# EAGLE design ant_track_2 (EAGLE 4.16)
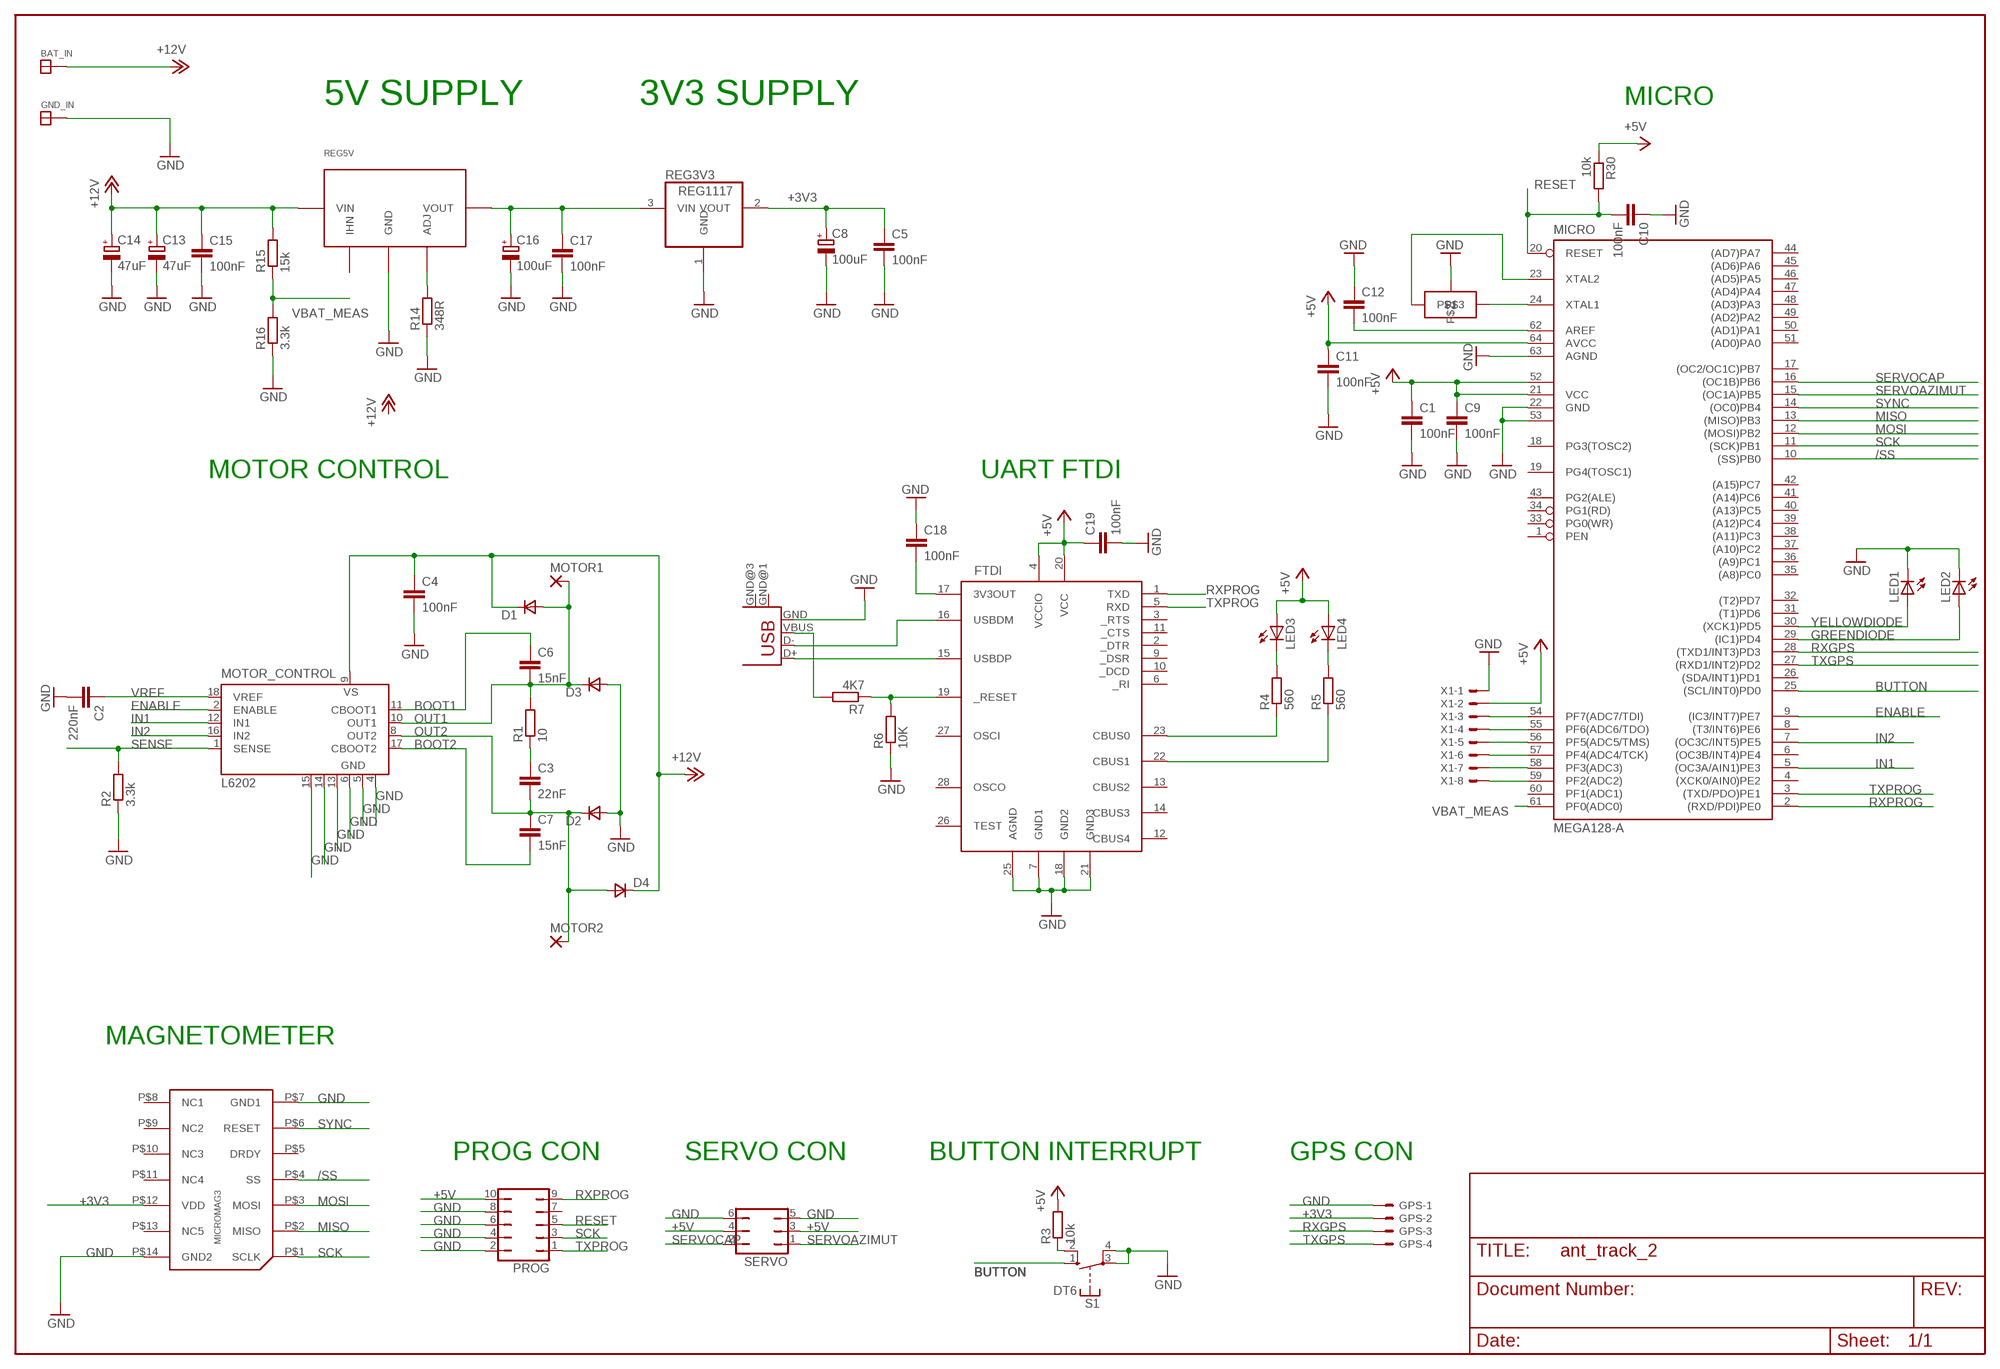
[diagram p0: schematic, sheet 1]

## Parts
BAT_IN  SOLDER_PAD150_75  [SOLD_PAD_150_75]
C1  100nF  C-EUC1206  [C1206]
C2  220nF  C-EUC1206  [C1206]
C3  22nF  C-EUC1206  [C1206]
C4  100nF  C-EUC1206  [C1206]
C5  100nF  C-EUC1206K  [C1206K]
C6  15nF  C-EUC1206  [C1206]
C7  15nF  C-EUC1206  [C1206]
C8  100uF  CPOL-EUSMCD  [SMC_D]
C9  100nF  C-EUC1206  [C1206]
C10  100nF  C-EUC1206  [C1206]
C11  100nF  C-EUC1206  [C1206]
C12  100nF  C-EUC1206  [C1206]
C13  47uF  CPOL-EUSMCD  [SMC_D]
C14  47uF  CPOL-EUSMCD  [SMC_D]
C15  100nF  C-EUC1206  [C1206]
C16  100uF  CPOL-EUSMCD  [SMC_D]
C17  100nF  C-EUC1206K  [C1206K]
C18  100nF  C-EUC0603K  [C0603K]
C19  100nF  C-EUC0603K  [C0603K]
D1  VAR2SOT23  [SOT-23]
D2  VAR2SOT23  [SOT-23]
D3  VAR2SOT23  [SOT-23]
D4  VAR2SOT23  [SOT-23]
FTDI  FT232RL  [SSOP28DB]
GND_IN  SOLDER_PAD150_75  [SOLD_PAD_150_75]
GPS  53047-04  [53047-04]
LED1  LEDCHIPLED_0805  [CHIPLED_0805]
LED2  LEDCHIPLED_0805  [CHIPLED_0805]
LED3  LEDCHIPLED_0805  [CHIPLED_0805]
LED4  LEDCHIPLED_0805  [CHIPLED_0805]
MICRO  MEGA128-A  [TQFP64]
MOTOR1  2,54/0,8  [2,54/0,8]
MOTOR2  2,54/0,8  [2,54/0,8]
MOTOR_CONTROL  L6202  [DIL18]
PROG  JP5Q  [JP5Q]
R1  10  R-EU_R1206  [R1206]
R2  3.3k  R-EU_R1206  [R1206]
R3  10k  R-EU_R1206W  [R1206W]
R4  560  R-EU_R0805  [R0805]
R5  560  R-EU_R0805  [R0805]
R6  10K  R-EU_R0603  [R0603]
R7  4K7  R-EU_R0603  [R0603]
R14  348R  R-EU_R1206  [R1206]
R15  15k  R-EU_R1206  [R1206]
R16  3.3k  R-EU_R1206  [R1206]
R30  10k  R-EU_R1206W  [R1206W]
REG3V3  REG1117  [SOT223]
REG5V  PTH  [PTH]
S1  DT6  [DT6]
SERVO  JP3Q  [JP3Q]
U$1  MICROMAG3  [MICROMAG3]
U$2  MICRO_RESO  [MICRO_CRYSTAL]
USB1  USB-MB-S  [USB-MB-S]
X1  53047-08  [53047-08]

## Nets
+3V3: C5.1 C8.+ GPS.2 REG3V3.2(VOUT) U$1.P$12(VDD)
+5V: C1.1 C9.1 C11.1 C16.+ C17.1 C19.1 FTDI.4(VCCIO) FTDI.20(VCC) LED3.A LED4.A MICRO.21(VCC) MICRO.52(VCC1) MICRO.64(AVCC) PROG.10 R3.2 R30.1 REG3V3.3(VIN) REG5V.P$3(VOUT) SERVO.3 SERVO.4 X1.2
+12V: BAT_IN.P$1 C4.1 C13.+ C14.+ C15.1 D1.1(C) D4.1(C) MOTOR_CONTROL.9(VS) R15.2 REG5V.P$1(VIN)
/SS: MICRO.10((SS)PB0) U$1.P$4(SS)
BOOT1: C6.1 MOTOR_CONTROL.11(CBOOT1)
BOOT2: C7.2 MOTOR_CONTROL.17(CBOOT2)
BUTTON: MICRO.25((SCL/INT0)PD0) S1.1(S)
ENABLE: MICRO.9((IC3/INT7)PE7) MOTOR_CONTROL.2(ENABLE)
GND: C1.2 C2.2 C4.2 C5.2 C8.- C9.2 C10.1 C11.2 C12.1 C13.- C14.- C15.2 C16.- C17.2 C18.1 C19.2 D2.3(A) D3.3(A) FTDI.7(GND1) FTDI.18(GND2) FTDI.21(GND3) FTDI.25(AGND) GND_IN.P$1 GPS.1 LED1.C LED2.C MICRO.22(GND) MICRO.53(GND1) MICRO.63(AGND) MOTOR_CONTROL.4(GND) MOTOR_CONTROL.5(GND) MOTOR_CONTROL.6(GND) MOTOR_CONTROL.13(GND) MOTOR_CONTROL.14(GND) MOTOR_CONTROL.15(GND) PROG.2 PROG.4 PROG.6 PROG.8 R2.1 R6.1 R14.1 R16.1 REG3V3.1(GND) REG5V.P$2(GND) S1.3(P) S1.4(P) SERVO.5 SERVO.6 U$1.P$7(GND1) U$1.P$14(GND2) U$2.P$2 USB1.GND X1.1
GREENDIODE: LED2.A MICRO.29((IC1)PD4)
IN1: MICRO.5((OC3A/AIN1)PE3) MOTOR_CONTROL.12(IN1)
IN2: MICRO.7((OC3C/INT5)PE5) MOTOR_CONTROL.16(IN2)
MISO: MICRO.13((MISO)PB3) U$1.P$2(MISO)
MOSI: MICRO.12((MOSI)PB2) U$1.P$3(MOSI)
N$2: C3.1 R1.1
N$5: R14.2 REG5V.P$4(ADJ)
N$9: R3.1 S1.2(S)
N$15: C12.2 MICRO.62(AREF)
N$16: MICRO.24(XTAL1) U$2.P$3
N$17: MICRO.23(XTAL2) U$2.P$1
N$27: FTDI.15(USBDP) USB1.D+
N$28: FTDI.16(USBDM) USB1.D-
N$29: FTDI.23(CBUS0) R4.1
N$30: FTDI.22(CBUS1) R5.1
N$31: LED3.C R4.2
N$32: LED4.C R5.2
N$33: FTDI.19(_RESET) R6.2 R7.1
N$34: R7.2 USB1.VBUS
N$35: C18.2 FTDI.17(3V3OUT)
N$42: MICRO.54(PF7(ADC7/TDI)) X1.3
N$43: MICRO.55(PF6(ADC6/TDO)) X1.4
N$44: MICRO.56(PF5(ADC5/TMS)) X1.5
N$45: MICRO.57(PF4(ADC4/TCK)) X1.6
N$46: MICRO.58(PF3(ADC3)) X1.7
N$47: MICRO.59(PF2(ADC2)) X1.8
OUT1: C6.2 D1.3(A) D3.1(C) MOTOR1.1(P) MOTOR_CONTROL.10(OUT1) R1.2
OUT2: C3.2 C7.1 D2.1(C) D4.3(A) MOTOR2.1(P) MOTOR_CONTROL.8(OUT2)
RESET: C10.2 MICRO.20(RESET) PROG.5 R30.2
RXGPS: GPS.3 MICRO.28((TXD1/INT3)PD3)
RXPROG: FTDI.1(TXD) MICRO.2((RXD/PDI)PE0) PROG.9
SCK: MICRO.11((SCK)PB1) PROG.3 U$1.P$1(SCLK)
SENSE: MOTOR_CONTROL.1(SENSE) R2.2
SERVOAZIMUT: MICRO.15((OC1A)PB5) SERVO.1
SERVOCAP: MICRO.16((OC1B)PB6) SERVO.2
SYNC: MICRO.14((OC0)PB4) U$1.P$6(RESET)
TXGPS: GPS.4 MICRO.27((RXD1/INT2)PD2)
TXPROG: FTDI.5(RXD) MICRO.3((TXD/PDO)PE1) PROG.1
VBAT_MEAS: MICRO.61(PF0(ADC0)) R15.1 R16.2
VREF: C2.1 MOTOR_CONTROL.18(VREF)
YELLOWDIODE: LED1.A MICRO.30((XCK1)PD5)
Unconnected: FTDI.2(_DTR) FTDI.3(_RTS) FTDI.6(_RI) FTDI.9(_DSR) FTDI.10(_DCD) FTDI.11(_CTS) FTDI.12(CBUS4) FTDI.13(CBUS2) FTDI.14(CBUS3) FTDI.26(TEST) FTDI.27(OSCI) FTDI.28(OSCO) MICRO.1(PEN) MICRO.4((XCK0/AIN0)PE2) MICRO.6((OC3B/INT4)PE4) MICRO.8((T3/INT6)PE6) MICRO.17((OC2/OC1C)PB7) MICRO.18(PG3(TOSC2)) MICRO.19(PG4(TOSC1)) MICRO.26((SDA/INT1)PD1) MICRO.31((T1)PD6) MICRO.32((T2)PD7) MICRO.33(PG0(WR)) MICRO.34(PG1(RD)) MICRO.35((A8)PC0) MICRO.36((A9)PC1) MICRO.37((A10)PC2) MICRO.38((A11)PC3) MICRO.39((A12)PC4) MICRO.40((A13)PC5) MICRO.41((A14)PC6) MICRO.42((A15)PC7) MICRO.43(PG2(ALE)) MICRO.44((AD7)PA7) MICRO.45((AD6)PA6) MICRO.46((AD5)PA5) MICRO.47((AD4)PA4) MICRO.48((AD3)PA3) MICRO.49((AD2)PA2) MICRO.50((AD1)PA1) MICRO.51((AD0)PA0) MICRO.60(PF1(ADC1)) PROG.7 REG5V.P$5(IHN) U$1.P$5(DRDY) U$1.P$8(NC1) U$1.P$9(NC2) U$1.P$10(NC3) U$1.P$11(NC4) U$1.P$13(NC5) USB1.GND@1(GND) USB1.GND@3(GND)

## Notes on the sheet
- 5V SUPPLY | 3V3 SUPPLY | MICRO
- MOTOR CONTROL | UART FTDI
- MAGNETOMETER
- PROG CON | SERVO CON | BUTTON INTERRUPT | GPS CON

## Library data of the parts
BAT_IN GND_IN = paparazzi:SOLDER_PAD
C1-C7 C9-C12 C15 C17-C19 = rcl:C-EU: CAPACITOR, European symbol
C8 C13 C14 C16 = rcl:CPOL-EU: POLARIZED CAPACITOR, European symbol
D1-D4 = zetex:VAR2SOT23: DIODE
FTDI = ftdichip:FT232RL: USB UART 4th Generation USB UART (USB <-> Serial) Controller
GPS = con-molex:53?-04: CONNECTOR wire to board 1.25 mm (.049 inch) pitch header
LED1-LED4 = led:LED: LED OSRAM: - CHIPLED LG R971, LG N971, LY N971, LG Q971, LY Q971, LO R971, LY R971 LH N974, LH R974 LS Q976, LO Q976, LY Q976 LO Q996 - Hyper CHIPLED LW Q18S LB Q993, LB Q99A, LB R99A - SideLED LS A670, LO A670, LY A670, LG A670, LP A670 LB A673, LV A673, LT A673, LW A673 LH A674 LY A675 LS A676, LA A676, LO A676, LY A676, LW A676 LS A679, LY A679, LG A679 - Hyper Micro SIDELED® LS Y876, LA Y876, LO Y876, LY Y876 LT Y87S - SmartLED LW L88C, LW L88S LB L89C, LB L89S, LG L890 LS L89K, LO L89K, LY L89K LS L896, LA L896, LO L896, LY L896 - TOPLED LS T670, LO T670, LY T670, LG T670, LP T670 LSG T670, LSP T670, LSY T670, LOP T670, LYG T670 LG T671, LOG T671, LSG T671 LB T673, LV T673, LT T673, LW T673 LH T674 LS T676, LA T676, LO T676, LY T676, LB T676, LH T676, LSB T676, LW T676 LB T67C, LV T67C, LT T67C, LS T67K, LO T67K, LY T67K, LW E67C LS E67B, LA E67B, LO E67B, LY E67B, LB E67C, LV E67C, LT E67C LW T67C LS T679, LY T679, LG T679 LS T770, LO T770, LY T770, LG T770, LP T770 LB T773, LV T773, LT T773, LW T773 LH T774 LS E675, LA E675, LY E675, LS T675 LS T776, LA T776, LO T776, LY T776, LB T776 LHGB T686 LT T68C, LB T68C - Hyper Mini TOPLED® LB M676 - Mini TOPLED Santana® LG M470 LS M47K, LO M47K, LY M47K Source: http://www.osram.convergy.de/
MICRO = atmel:MEGA128: MICROCONTROLLER 128 Kbytes FLASH 4 Kbytes SRAM 4 Kbytes EEPROM DUAL USART 8-channel 10 bit ADC Source: avr.lbr
MOTOR1 MOTOR2 = wirepad:2,54/0,8: THROUGH-HOLE PAD
MOTOR_CONTROL = st-microelectronics:L620: DMOS FULL BRIDGE DRIVER
PROG = jumper:JP5Q: JUMPER
R1-R7 R14-R16 R30 = rcl:R-EU_: RESISTOR, European symbol
REG3V3 = burr-brown:REG1117: 800mA and 1A Low Dropout (LDO) Positive Regulator 1.8V, 2.5V, 2.85V, 3.3V, 5V, and Adj
REG5V = paparazzi:PTH
S1 = switch-misc:DT: ITT SWITCH
SERVO = jumper:JP3Q: JUMPER
U$1 = paparazzi:MICROMAG3
U$2 = paparazzi:MICRO_RESO
USB1 = con-usb-2:USB: USB Connectors
X1 = con-molex:53?-08: CONNECTOR wire to board 1.25 mm (.049 inch) pitch header

## Board
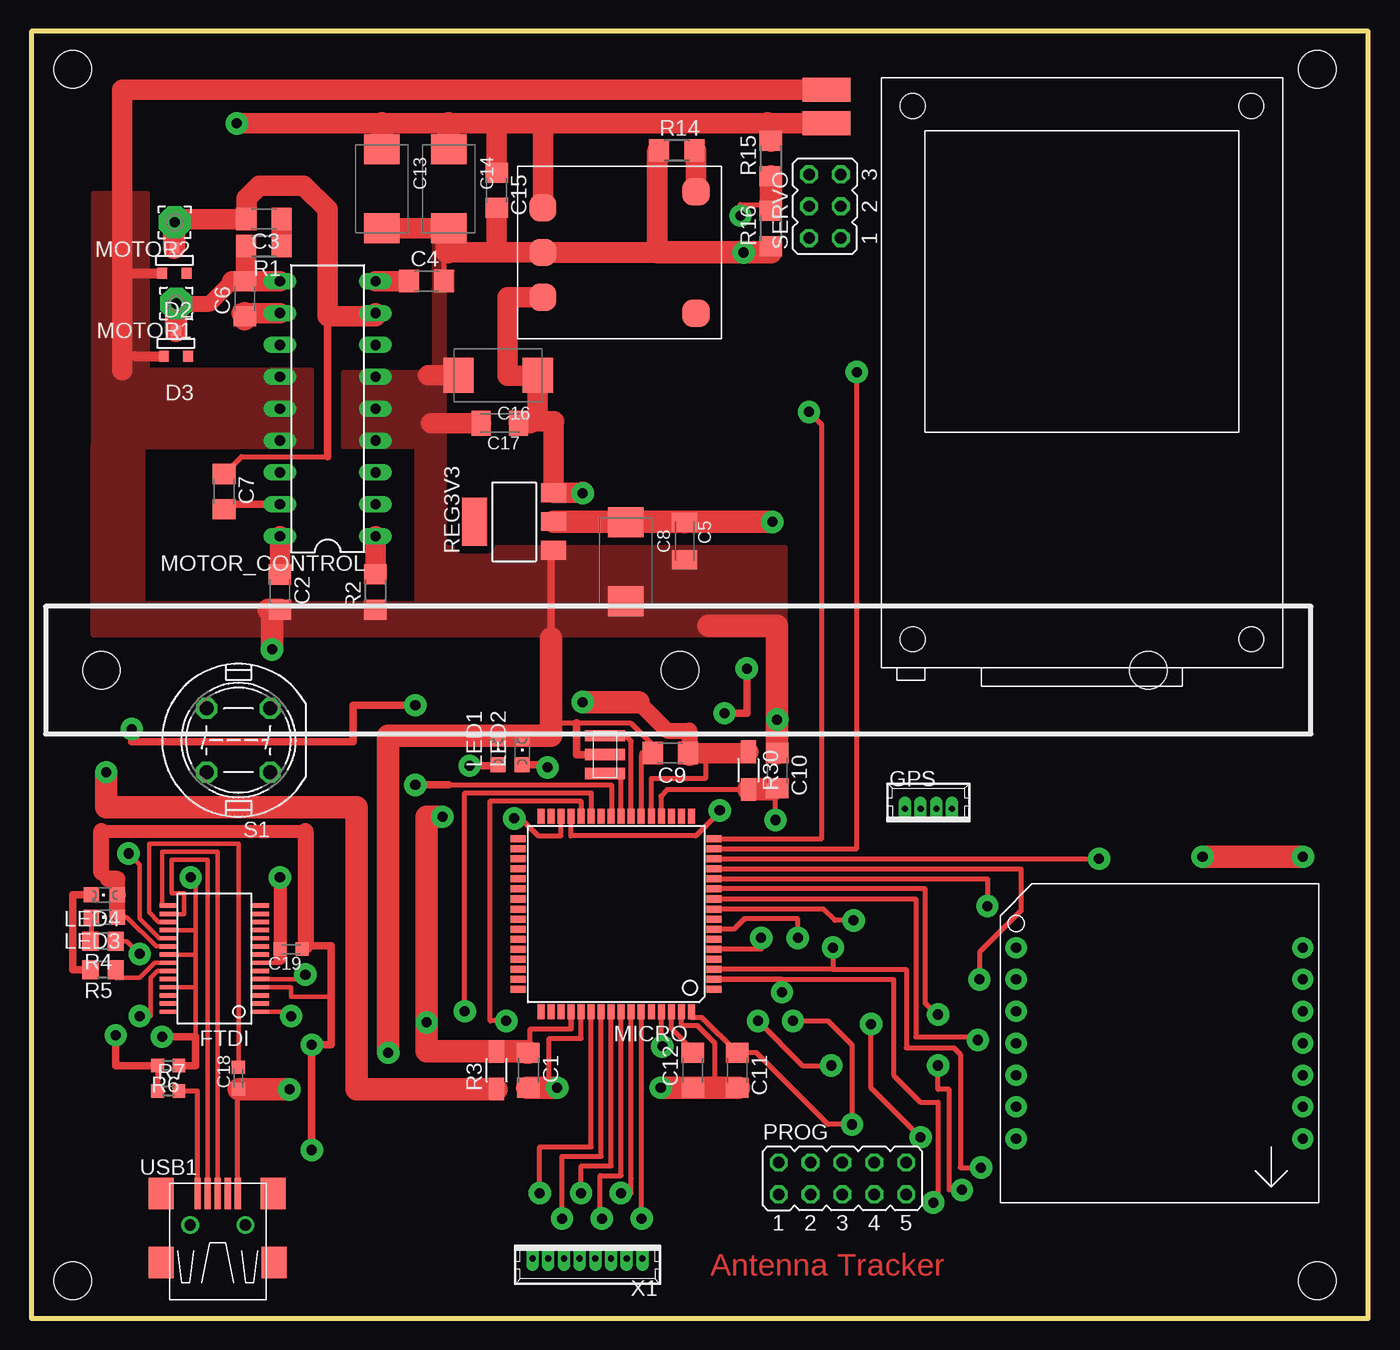
[diagram p1: board, top side]
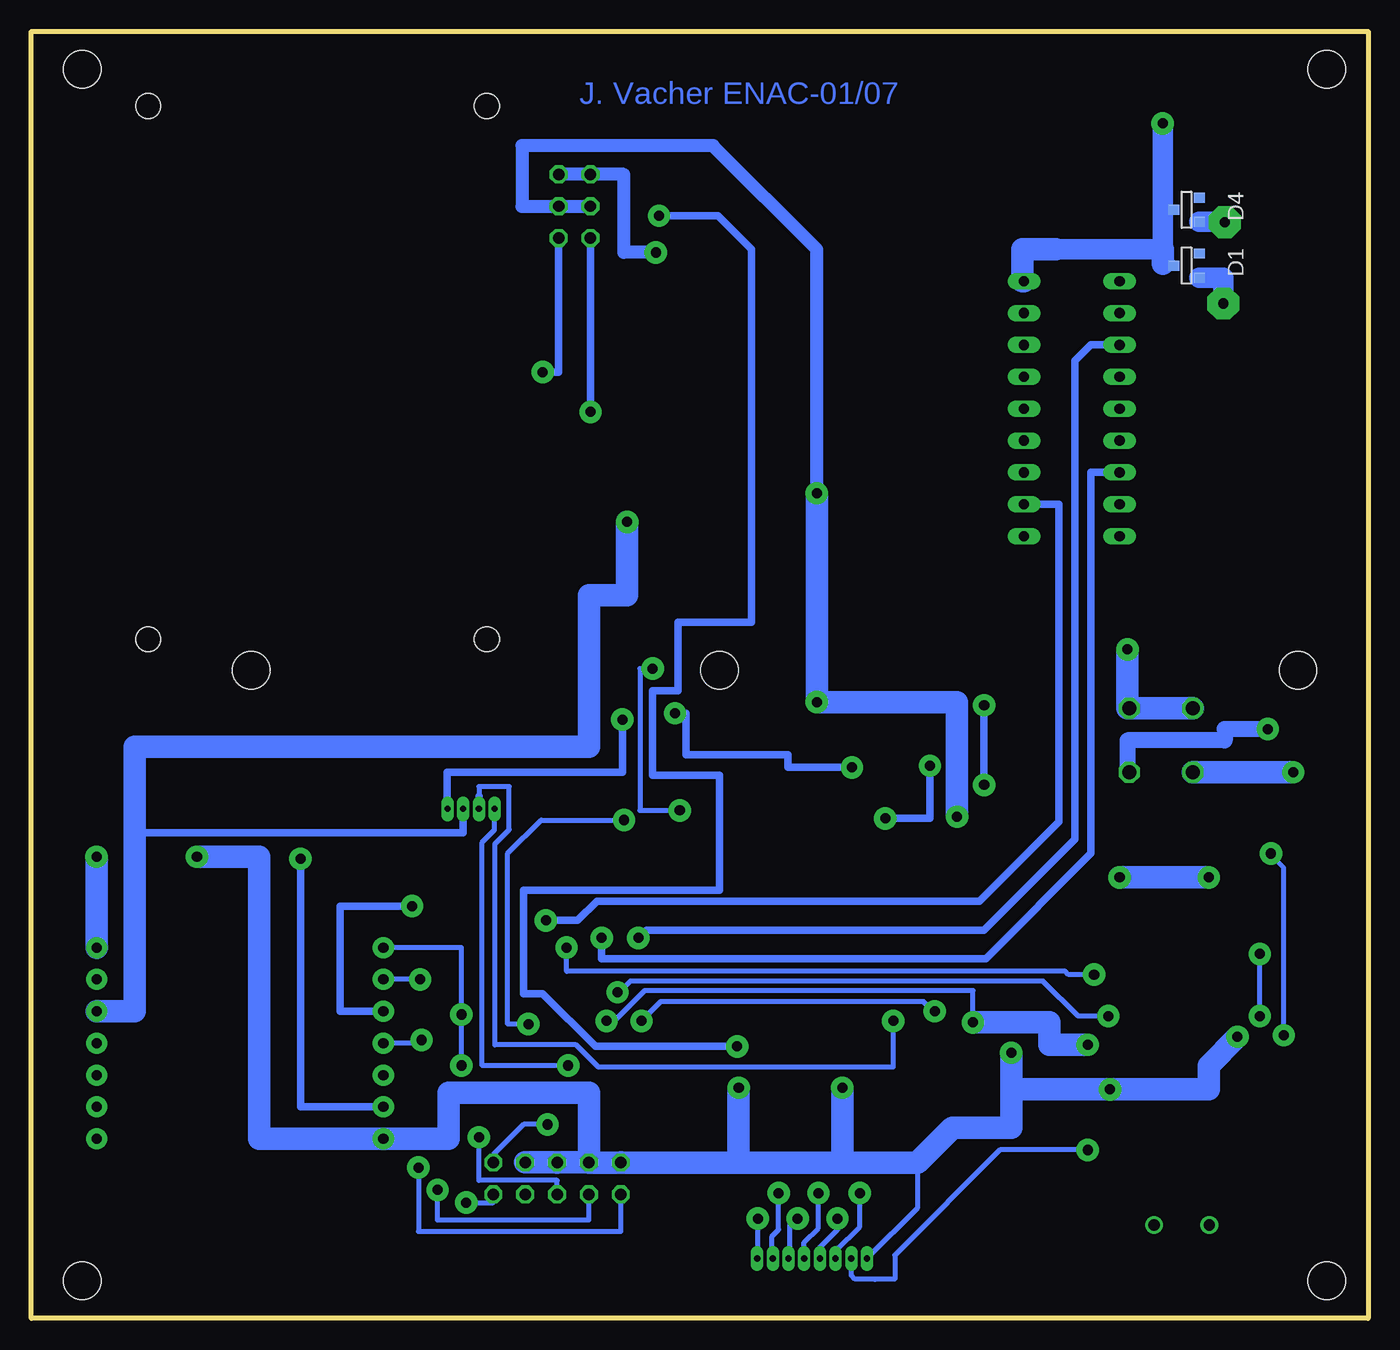
[diagram p2: board, bottom side, seen from below]

Size 106.53 x 102.54 mm. Coordinates in mm from the lower left corner, seen from the top.
Outline: 0,0 106.53,0 106.53,102.54 0,102.54 0,0
Copper layers (1*16): Top 0.035mm / dielectric 1.5mm / Bottom 0.035mm
Design rules "default": minimum track width 10mil, minimum drill 19mil, track to track 8mil, track to pad 8mil, pad to pad 8mil, via to via 8mil, smd to smd 8mil, copper to edge 40mil, drill to drill 8mil, minimum pad ring 10mil, minimum via ring 8mil, stop-mask expansion 4mil, vias tented up to drill 0mil, thermal gap 10mil
Holes 3 mm at 3.3,99.53 102.48,99.53 102.48,3.01 3.3,3.01 89.02,51.65 51.68,51.65 5.58,51.65

### Footprints (pad centres in the part's own frame; a part is rotated, then mirrored left to right if it is on the bottom)
SOLD_PAD_150_75 = smd 3.81 x 1.905: P$1 0,0
C1206 = smd 1.6 x 1.8: 1 -1.4,0; 2 1.4,0
C1206K = smd 1.5 x 2: 1 -1.5,0; 2 1.5,0
SMC_D = smd 2.4 x 2.8: + -3.15,0; - 3.15,0
C0603K = smd 1.05 x 1.08: 1 -0.875,0; 2 0.875,0
SOT-23 = smd 0.787 x 0.889: 1 0.025,-1.016; 2 -0.94,1.016; 3 0.991,1.016
SSOP28DB = smd 0.348 x 1.397: 1 -4.225,-3.656; 2 -3.575,-3.656; 3 -2.925,-3.656; 4 -2.275,-3.656; 5 -1.625,-3.656; 6 -0.975,-3.656; 7 -0.325,-3.656; 8 0.325,-3.656; 9 0.975,-3.656; 10 1.625,-3.656; 11 2.275,-3.656; 12 2.925,-3.656; 13 3.575,-3.656; 14 4.225,-3.656; 15 4.225,3.656; 16 3.575,3.656; 17 2.925,3.656; 18 2.275,3.656; 19 1.625,3.656; 20 0.975,3.656; 21 0.325,3.656; 22 -0.325,3.656; 23 -0.975,3.656; 24 -1.625,3.656; 25 -2.275,3.656; 26 -2.925,3.656; 27 -3.575,3.656; 28 -4.225,3.656
53047-04 = drill 0.5 pad 0.698 long: 1 1.875,0; 2 0.625,0; 3 -0.625,0; 4 -1.875,0
CHIPLED_0805 = smd 1.2 x 1.2: A 0,-1.05; C 0,1.05
TQFP64 = smd 1.194 x 0.559: 1 -7.8,6; 2 -7.8,5.2; 3 -7.8,4.4; 4 -7.8,3.6; 5 -7.8,2.8; 6 -7.8,2; 7 -7.8,1.2; 8 -7.8,0.4; 9 -7.8,-0.4; 10 -7.8,-1.2; 11 -7.8,-2; 12 -7.8,-2.8; 13 -7.8,-3.6; 14 -7.8,-4.4; 15 -7.8,-5.2; 16 -7.8,-6; 33 7.8,-6; 34 7.8,-5.2; 35 7.8,-4.4; 36 7.8,-3.6; 37 7.8,-2.8; 38 7.8,-2; 39 7.8,-1.2; 40 7.8,-0.4; 41 7.8,0.4; 42 7.8,1.2; 43 7.8,2; 44 7.8,2.8; 45 7.8,3.6; 46 7.8,4.4; 47 7.8,5.2; 48 7.8,6 | smd 0.559 x 1.194: 17 -6,-7.8; 18 -5.2,-7.8; 19 -4.4,-7.8; 20 -3.6,-7.8; 21 -2.8,-7.8; 22 -2,-7.8; 23 -1.2,-7.8; 24 -0.4,-7.8; 25 0.4,-7.8; 26 1.2,-7.8; 27 2,-7.8; 28 2.8,-7.8; 29 3.6,-7.8; 30 4.4,-7.8; 31 5.2,-7.8; 32 6,-7.8; 49 6,7.8; 50 5.2,7.8; 51 4.4,7.8; 52 3.6,7.8; 53 2.8,7.8; 54 2,7.8; 55 1.2,7.8; 56 0.4,7.8; 57 -0.4,7.8; 58 -1.2,7.8; 59 -2,7.8; 60 -2.8,7.8; 61 -3.6,7.8; 62 -4.4,7.8; 63 -5.2,7.8; 64 -6,7.8
2,54/0,8 = drill 0.813 pad 2.54 octagon: 1 0,0
DIL18 = drill 0.813 long: 1 -10.16,-3.81; 2 -7.62,-3.81; 3 -5.08,-3.81; 4 -2.54,-3.81; 5 0,-3.81; 6 2.54,-3.81; 7 5.08,-3.81; 8 7.62,-3.81; 9 10.16,-3.81; 10 10.16,3.81; 11 7.62,3.81; 12 5.08,3.81; 13 2.54,3.81; 14 0,3.81; 15 -2.54,3.81; 16 -5.08,3.81; 17 -7.62,3.81; 18 -10.16,3.81
JP5Q = drill 0.914 octagon: 1 -5.08,-1.27; 2 -5.08,1.27; 3 -2.54,-1.27; 4 -2.54,1.27; 5 0,-1.27; 6 0,1.27; 7 2.54,-1.27; 8 2.54,1.27; 9 5.08,-1.27; 10 5.08,1.27
R1206 = smd 1.6 x 1.803: 1 -1.422,0; 2 1.422,0
R1206W = smd 1.8 x 1.2: 1 -1.499,0; 2 1.499,0
R0805 = smd 1.3 x 1.5: 1 -1.012,0; 2 1.012,0
R0603 = smd 1 x 1.1: 1 -0.85,0; 2 0.85,0
SOT223 = smd 1.499 x 2.007: 1 -2.261,-3.15; 2 0.025,-3.15; 3 2.311,-3.15 | smd 3.81 x 2.007: 4 0,3.15
PTH = smd 2.184 x 2.184: P$1 -6.096,3.556; P$2 -6.096,0; P$3 -6.096,-3.556; P$4 6.096,4.826; P$5 6.096,-4.826
DT6 = drill 1.118 octagon: 1 -2.54,2.54; 2 2.54,2.54; 3 2.54,-2.54; 4 -2.54,-2.54
JP3Q = drill 0.914 octagon: 1 -2.54,-1.27; 2 -2.54,1.27; 3 0,-1.27; 4 0,1.27; 5 2.54,-1.27; 6 2.54,1.27
MICROMAG3 = drill 0.8 pad 1.676 round: P$1 -7.62,-11.43; P$2 -5.08,-11.43; P$3 -2.54,-11.43; P$4 0,-11.43; P$5 2.54,-11.43; P$6 5.08,-11.43; P$7 7.62,-11.43; P$8 7.62,11.43; P$9 5.08,11.43; P$10 2.54,11.43; P$11 0,11.43; P$12 -2.54,11.43; P$13 -5.08,11.43; P$14 -7.62,11.43
MICRO_CRYSTAL = smd 0.9 x 3.2: P$1 -1.5,0; P$2 0,0; P$3 1.5,0
SAM_LS = hole 2: 0,0; 42.5,0; 0,27; 42.5,27
USB-MB-S = smd 2.5 x 0.5: D+ 2.5,0; D- 2.5,0.8; GND 2.5,-1.6; ID 2.5,-0.8; VBUS 2.5,1.6 | smd 2.5 x 2: GND@1 -3,4.5; GND@2 2.5,4.5; GND@3 -3,-4.5; GND@4 2.5,-4.4 | drill 0.9 round: P$5 0,2.2; P$6 0,-2.2
53047-08 = drill 0.5 pad 0.698 long: 1 4.375,0; 2 3.125,0; 3 1.875,0; 4 0.625,0; 5 -0.625,0; 6 -1.875,0; 7 -3.125,0; 8 -4.375,0

### Placement (x,y rotation side)
BAT_IN  63.37,95.21 0 top
C1  39.62,19.77 270 top
C2  19.81,57.87 270 top
C3  18.54,87.59 180 top
C4  31.49,82.64 0 top
C5  52.06,61.94 270 top
C6  17.01,81.24 89.8 top
C7  15.36,65.88 270 top
C8  47.37,60.29 270 top
C9  50.92,45.05 180 top
C10  59.43,43.65 270 top
C11  56.26,19.77 270 top
C12  52.7,19.77 90 top
C13  27.94,90 270 top
C14  33.27,90 270 top
C15  37.08,89.88 270 top
C16  37.21,75.15 180 top
C17  37.33,71.34 180 top
C18  16.5,19.14 90 top
C19  20.7,29.43 180 top
D1  14.47,83.91 270 bottom
D2  11.43,84.29 180 top
D3  11.55,77.69 180 top
D4  14.47,88.35 270 bottom
FTDI  14.6,28.66 90 top
GND_IN  63.37,97.88 0 top
GPS  71.5,40.6 0 top
LED1  37.21,45.17 0 top
LED2  39.11,45.17 0 top
LED3  5.84,31.97 90 top
LED4  5.84,33.74 90 top
MICRO  46.6,32.22 180 top
MOTOR1  11.55,80.86 180 top
MOTOR2  11.43,87.34 180 top
MOTOR_CONTROL  23.62,72.48 90 top
PROG  64.64,11.16 0 top
R1  18.54,85.43 180 top
R2  27.43,57.87 90 top
R3  37.08,19.77 90 top
R4  5.71,30.06 180 top
R5  5.71,27.77 180 top
R6  10.92,20.15 180 top
R7  10.92,18.12 0 top
R14  51.43,93.05 0 top
R15  58.92,92.42 90 top
R16  58.92,86.83 90 top
R30  57.15,43.65 270 top
REG3V3  38.48,63.46 90 top
REG5V  46.86,84.92 0 top
S1  16.5,46.06 180 top
SERVO  63.24,88.61 90 top
U$1  89.91,21.93 270 top
U$2  45.72,44.92 270 top
U$3  [SAM_LS]  70.23,96.61 270 top
USB1  14.85,7.46 90 top
X1  44.32,4.79 180 top

### Tracks (layer width: path | path; a pad name or v marks a point on that pad's centre or on a via)
+3V3  (via drill 0.8 pad 1.78)
  Top 1.778: REG3V3.2 47.37,63.49 | 47.37,63.49 52.06,63.49 C5.1 52.06,63.46 | 47.37,63.49 47.37,63.72 | 47.37,63.49 C8.+ | 52.06,63.46 51.94,63.46 | 52.06,63.46 v59.05,63.46
  Bottom 0.61: GPS.2 72.12,38.7 98.29,38.7
  Bottom 1.778: U$1.P$12 98.29,24.47 98.29,38.7 98.29,45.55 62.1,45.55 62.1,57.62 59.05,57.62 v59.05,63.46
+5V  (via drill 0.8 pad 1.78)
  Top 0.356: FTDI.20 9.94,29.64 7.62,31.97 6.85,31.97 | 23.87,25.62 20.7,25.62 20.7,26.39 FTDI.4 | C19.1 21.57,29.68 21.84,29.68
  Top 0.406: 38.81,21.68 39.75,21.68 39.75,21.93 | 23.87,25.62 23.87,24.86 | MICRO.21 49.4,43.02 53.72,43.02 53.72,45.05 53.72,45.17 | MICRO.64 52.6,23.96 53.46,23.96 C11.1 57.78,21.17 63.5,15.46 v65.4,15.46 65.4,21.81 63.5,23.71 v60.7,23.71 | 39.75,23.08 43,23.08 MICRO.52 43,24.47 43.05,24.47 43.05,23.08 39.75,23.08 | 39.75,21.93 39.75,23.08 | 31.49,21.93 39.75,21.93 | 52.45,45.05 C9.1 | 5.58,35.52 5.71,35.52 5.71,35.01 6.09,35.01
  Top 0.61: C1.1 39.75,21.3 39.75,21.68 | 21.84,29.68 23.87,29.68 23.87,25.62 23.87,21.81 v22.35,21.81 v22.35,13.42
  Top 1.016: 5.58,38.82 21.84,38.82
  Top 1.27: 21.84,38.82 21.84,29.68 | LED3.A 6.85,31.97 6.85,33.71 LED4.A 6.85,33.74 6.85,35.01 6.09,35.01 | 5.58,35.52 5.58,38.82 | 52.45,45.05 52.45,46.83 50.67,46.83 48.38,49.11
  Top 1.626: 39.49,71.34 C17.1 | 39.49,71.34 39.75,71.34 40.36,71.95 C16.+ 40.38,75.15 40.36,75.12 37.97,75.12 37.97,81.37 REG5V.P$3 | 39.49,71.34 39.49,71.46 41.65,71.46 41.63,71.44 REG3V3.3 43.91,65.77 | R30.1 56.87,45.15 56.76,45.05 53.72,45.05 52.45,45.05
  Top 1.778: v43.94,65.75 43.91,65.77 | 52.45,45.05 52.45,44.92 | v43.94,49.11 48.38,49.11 | 39.49,21.27 39.49,21.17 C1.1 | 39.49,21.27 R3.2 37.08,21.3 31.49,21.3 31.49,21.93 v31.49,23.58 31.49,39.97 v32.76,39.97 | 39.49,21.27 39.49,21.3 | REG5V.P$3 40.76,81.5
  Bottom 0.406: v65.4,15.46 67.31,15.46 69.72,13.04 PROG.10 69.72,12.41 | v31.49,23.58 31.49,26.12 57.65,26.12 60.07,23.71 v60.7,23.71 | X1.2 41.19,3.44 40.89,3.14 39.37,3.14 | 39.37,3.14 39.24,3.14 | v22.35,13.42 29.33,13.42 37.71,5.04 37.71,3.14 39.37,3.14
  Bottom 1.016: v43.94,65.75 43.94,85.18 52.19,93.43 67.43,93.43 67.43,88.61 SERVO.3 64.51,88.73 64.38,88.73 64.38,88.61 SERVO.4 61.84,88.61
  Bottom 1.778: v43.94,65.75 v43.94,49.11 32.76,49.11 v32.76,39.97 | v31.49,23.58 25.39,23.58 25.39,21.81 v22.35,21.81
+12V  (via drill 0.8 pad 1.78)
  Top 0.61: REG5V.P$1 40.89,88.48 40.89,88.61 40.76,88.61 REG5V.P$1
  Top 1.626: BAT_IN.P$1 v16.38,95.21 27.94,95.21 33.27,95.21 37.08,95.21 | 37.08,95.21 40.76,95.21 | 40.76,95.21 58.67,95.21 | 40.76,95.21 REG5V.P$1 | 37.08,95.21 C15.1 | MOTOR_CONTROL.9 C4.1
  Top 1.778: 27.94,95.21 C13.+ | 33.27,95.21 C14.+ | 58.67,95.21 58.67,95.08 58.92,95.08 R15.2
  Bottom 0.406: D4.1 15.36,88.33 15.36,88.35 16.38,88.35 | D1.1 15.87,83.88 15.87,84.04 15.49,84.04
  Bottom 0.61: 15.49,84.04 16.38,84.04
  Bottom 1.626: 16.38,88.35 16.38,85.18 24.89,85.18 | 16.38,88.35 v16.38,95.21 | 16.38,88.35 16.38,88.33
  Bottom 1.778: 16.38,84.04 16.38,85.18 | MOTOR_CONTROL.9 27.55,82.64 27.55,85.18 24.89,85.18
/SS  (via drill 0.8 pad 1.78)
  Top 0.406: MICRO.10 70.48,33.42 70.48,22.44 75.18,22.44 v75.43,22.19
  Bottom 0.406: v75.43,22.19 75.69,21.93 U$1.P$4
BOOT1
  Top 1.626: 16.76,80.1 17.01,80.1 MOTOR_CONTROL.11
  Top 1.778: C6.1 17.01,80.1 | C6.1 | C6.1 17.01,79.59
BOOT2
  Top 0.61: 15.23,64.47 15.23,64.35 | C7.2 15.23,64.47 | MOTOR_CONTROL.17 15.23,64.86 15.23,64.47
BUTTON  (via drill 0.8 pad 1.78)
  Top 0.406: MICRO.25 46.22,40.02 46.22,42.51 33.27,42.51
  Top 0.61: v30.6,42.51 33.27,42.51 | v30.6,48.86 25.65,48.86 25.65,45.94 8,45.94 v8,46.95
  Bottom 0.61: v30.6,48.86 v30.6,42.51
  Bottom 1.27: v8,46.95 11.43,46.95 11.43,46.06 19.17,46.06 19.17,43.52 S1.1
ENABLE  (via drill 0.8 pad 1.78)
  Top 0.406: MICRO.9 63.11,32.62 64.02,31.71 v65.53,31.71
  Bottom 0.61: MOTOR_CONTROL.2 24.63,64.86 24.63,39.59 30.98,33.24 61.46,33.24 62.99,31.71 v65.53,31.71
GND  (via drill 0.8 pad 1.78)
  Top 0.356: FTDI.7 19.81,28.34 19.81,29.3 19.82,29.3 C19.2 | 13.08,22.44 13.08,26.39 | 13.08,28.99 13.08,29.04 | 13.08,29.04 13.08,30.95 13.08,35.14 | 13.08,30.94 FTDI.18 | 13.08,28.99 FTDI.21 | 13.08,26.39 FTDI.25 | 13.08,28.92 13.08,28.99 | 13.08,28.92 13.08,29.04 | 13.08,26.39 13.08,28.92
  Top 0.406: MICRO.53 43.81,22.31 41.27,22.31 41.27,18.38 | C18.1 16.5,18.5 16.45,18.5 USB1.GND | 11.93,20.15 R6.1 | C9.2 48.64,45.05 48.64,44.79 48.6,44.79 MICRO.22 | 33.02,84.92 32.89,84.92 C4.2 | 13.08,30.95 13.08,30.94 | MICRO.63 51.8,23.33 53.08,23.33 54.48,21.93 54.48,18.38 | C12.1 | C11.2 | 41.4,47.46 43.43,47.46 47.75,47.46 49.52,45.68 C9.2
  Top 0.61: 43.43,47.46 43.43,44.92 U$2.P$2 46.73,44.92 | 49.91,45.05 C9.2 | 41.27,18.38 39.75,18.38 39.74,18.37 C1.2 | LED2.C LED1.C | LED2.C 39.11,46.19 | LED2.C 41.4,46.22 41.4,46.44 | v10.41,22.44 13.08,22.44 13.08,20.15 11.93,20.15 | 13.08,35.14 v12.7,35.14 | REG3V3.1 41.42,61.2 41.4,61.18 41.4,54.19
  Top 0.813: 8.25,76.67 D3.3 | 7.23,83.27 D2.3
  Top 1.016: v19.81,35.14 19.81,29.3 19.81,28.66
  Top 1.626: 7.23,75.53 7.23,83.27 7.23,97.88 GND_IN.P$1 | 31.62,75.15 C16.- | 31.87,71.34 C17.2 | C13.- 33.02,86.85 33.02,84.92 33.27,84.92 35.17,84.92 | 35.17,84.92 37.08,84.92 | 37.08,84.92 REG5V.P$2 | 35.17,84.92 34.92,84.92 | 37.08,84.92 C15.2
  Top 1.676: 58.92,84.92 R16.1 | REG5V.P$2 49.91,84.92 49.91,93.05 R14.1
  Top 1.778: 58.92,84.92 v56.76,84.92 49.91,84.92 | 41.4,54.19 41.4,47.46 41.4,46.44 28.44,46.44 v28.44,21.17 | 53.97,55.21 59.43,55.21 v59.43,47.71 C10.1 | 19.17,56.47 18.92,56.47 | 19.17,56.47 C2.2 | v50.16,18.38 C12.1 54.48,18.38 C11.2 56.38,18.38 | 39.49,18.38 41.27,18.38 v41.91,18.38 | C18.1 v20.57,18.25 | 33.27,84.92 C14.- | v19.17,53.3 19.17,56.47 | v93.34,36.79 v101.34,36.79
  Bottom 0.406: X1.1 35.94,8.79 35.94,12.41
  Bottom 0.61: v59.43,47.71 59.43,43.52 73.4,43.52 73.4,40.6 GPS.1
  Bottom 1.016: v56.76,84.92 59.3,84.92 59.3,91.15 SERVO.6 SERVO.5 64.64,91.15
  Bottom 1.778: 28.44,18.25 28.44,15.2 33.14,15.2 35.94,12.41 41.91,12.41 | 50.16,12.41 v50.16,18.38 | 28.44,18.25 v28.44,21.17 | 28.44,18.25 v20.57,18.25 12.7,18.25 12.7,20.15 v10.41,22.44 | v12.7,35.14 v19.81,35.14 | 41.91,12.41 50.16,12.41 | PROG.6 PROG.8 | PROG.6 64.64,12.41 | PROG.4 PROG.6 | PROG.4 62.1,12.41 | PROG.4 62.1,18 73.27,18 73.27,14.31 U$1.P$7 88.39,14.31 88.39,36.79 v93.34,36.79 | 41.91,12.41 v41.91,18.38 | PROG.4 62.07,12.41 59.56,12.41 | 59.56,12.41 PROG.2 | 50.16,12.41 59.56,12.41 | S1.3 S1.4 19.17,48.6 v19.17,53.3 | v101.34,36.79 U$1.P$14
  pour Top (isolate 0.406, no thermals): 22.35,75.53 9.27,75.53 9.27,89.62 4.95,89.62 4.95,69.43 22.35,69.43
  pour Top (isolate 0.61, no thermals): 32.89,85.56 32.89,61.43 60.07,61.43 60.07,54.45 4.95,54.45 4.95,69.68 8.88,69.68 8.88,56.98 30.73,56.98 30.73,69.43 24.89,69.43 24.89,75.4 32.13,75.4 32.13,85.56
GREENDIODE  (via drill 0.8 pad 1.78)
  Top 0.406: MICRO.29 43,38.44 52.95,38.44 54.86,40.35 v54.86,40.48
  Top 0.61: LED2.A 41.14,44.12 v41.14,43.9 | v57.02,51.78 57.02,48.22 v55.24,48.22
  Bottom 0.406: v54.86,40.48 58.03,40.48 58.03,51.78 v57.02,51.78
  Bottom 0.61: 41.14,44.03 v41.14,43.9 46.22,43.9 46.22,44.92 54.35,44.92 54.35,48.22 v55.24,48.22
IN1  (via drill 0.8 pad 1.78)
  Top 0.406: MICRO.5 58.16,29.42 v58.16,30.31
  Bottom 0.61: MOTOR_CONTROL.12 21.97,77.56 22.09,77.56 23.36,76.29 23.36,38.19 30.6,30.95 57.53,30.95 v58.16,30.31
IN2  (via drill 0.8 pad 1.78)
  Top 0.406: MICRO.7 56,31.02 56.82,31.84 56.89,31.84 | v61.08,30.31 61.08,31.84 56.89,31.84 | 56.89,31.84 56.76,31.84
  Bottom 0.61: v61.08,30.31 61.08,28.66 38.98,28.66 | 38.98,28.66 38.86,28.66 | 19.81,67.53 MOTOR_CONTROL.16 22.09,67.4 22.09,37.05 30.48,28.66 38.98,28.66
MISO  (via drill 0.8 pad 1.78)
  Top 0.406: MICRO.13 78.86,35.82 78.86,32.47 75.56,29.17 v75.56,27.01
  Bottom 0.406: 78.61,27.01 78.61,27.14 | 78.61,27.01 U$1.P$2 v75.56,27.01 78.61,27.01
MOSI  (via drill 0.8 pad 1.78)
  Top 0.406: MICRO.12 54.47,35.02 54.48,35.01 76.2,35.01 v76.2,32.85
  Bottom 0.61: v76.2,32.85 81.91,32.85 81.91,24.47 78.35,24.47 | 78.35,24.47 U$1.P$3 | 78.35,24.47 78.35,24.6
N$1  (via drill 0.8 pad 1.78)
  other vias: 3.3,99.53
N$2
  Top 1.626: R1.1 19.93,85.43 19.94,85.44 C3.1
N$3  (via drill 0.8 pad 1.78)
  other vias: 102.48,99.53
N$4  (via drill 0.8 pad 1.78)
  other vias: 102.48,3.01
N$5
  Top 1.626: R14.2 52.95,93.05 REG5V.P$4
N$6  (via drill 0.8 pad 1.78)
  other vias: 3.3,3.01
N$8  (via drill 0.8 pad 1.78)
  other vias: 5.58,51.65
N$9  (via drill 0.8 pad 1.78)
  Top 1.778: R3.1 25.9,18.27 25.9,40.73 5.96,40.73 v5.96,43.52
  Bottom 1.778: v5.96,43.52 S1.2
N$13  (via drill 0.8 pad 1.78)
  other vias: 51.68,51.65
N$15
  Top 0.406: C12.2 52.7,21.42 51,23.12 MICRO.62
N$16
  Top 0.406: MICRO.24 47,43.4 45.72,43.4
  Top 0.61: 45.72,43.4 U$2.P$3
N$17
  Top 0.406: MICRO.23 47.8,46.01 47.37,46.44 45.72,46.44
  Top 0.61: 45.84,46.44 45.82,46.42 U$2.P$1 45.72,46.44
N$27
  Top 0.356: USB1.D+ 14.85,37.17 10.41,37.17 10.41,32.89 FTDI.15
N$28
  Top 0.356: USB1.D- 14.05,36.54 11.2,36.54 11.2,33.87 12.19,33.87 12.19,32.22 10.79,32.22 | 10.79,32.22 10.79,32.24 FTDI.16 | 10.79,32.22 10.44,32.22
N$29  (via drill 0.8 pad 1.78)
  Top 0.356: FTDI.23 10.07,27.69 9.52,27.14 9.52,24.09 v8.63,24.09 | v8.63,29.04 7.62,30.06 R4.1
  Bottom 0.406: v8.63,24.09 v8.63,29.04
N$30
  Top 0.356: FTDI.22 9.83,28.34 8.63,27.14 6.73,27.14
  Top 0.406: R5.1 6.73,27.14
N$31
  Top 0.406: R4.2 4.79,30.15 LED3.C
N$32
  Top 0.61: LED4.C 3.3,33.74 3.3,27.77 R5.2
N$33  (via drill 0.8 pad 1.78)
  Top 0.356: FTDI.19 10.18,30.29 8.63,31.84 8.63,36.16 v7.74,37.05
  Top 0.406: R6.2 R7.1
  Top 0.61: v6.73,22.57 6.73,20.15 R6.2
  Bottom 0.356: 6.73,35.78 6.73,35.9 7.74,36.92 v7.74,37.05
  Bottom 0.406: v6.73,22.57 6.73,35.78
N$34
  Top 0.406: USB1.VBUS 13.25,18.12 R7.2
N$35
  Top 0.356: C18.2 16.5,37.81 9.39,37.81 9.39,32.35 10.16,31.58 10.16,31.59 FTDI.17
N$36  (via drill 0.8 pad 1.78)
  other vias: 70.23,54.06
N$37  (via drill 0.8 pad 1.78)
  other vias: 97.28,54.06
N$42  (via drill 0.8 pad 1.78)
  Top 0.406: MICRO.54 44.6,13.68 40.51,13.68 v40.51,10
  Bottom 0.406: v40.51,10 40.51,7.33 42.41,5.42 42.41,4.79 X1.3
N$43  (via drill 0.8 pad 1.78)
  Top 0.406: MICRO.55 45.4,12.92 42.29,12.92 v42.29,7.96
  Bottom 0.406: X1.4 43.68,4.79 43.68,5.68 42.29,7.07 v42.29,7.96
N$44  (via drill 0.8 pad 1.78)
  Top 0.406: MICRO.56 46.2,12.15 43.81,12.15 v43.81,10
  Bottom 0.406: v43.81,10 43.81,7.2 44.95,6.06 44.94,6.06 X1.5
N$45  (via drill 0.8 pad 1.78)
  Top 0.406: MICRO.57 47,11.39 45.33,11.39 45.33,7.96 v45.46,7.96
  Bottom 0.406: X1.6 46.1,4.79 46.1,7.96 v45.46,7.96
N$46  (via drill 0.8 pad 1.78)
  Top 0.406: MICRO.58 47.8,11.14 47.8,10 47.75,10 v46.98,10
  Bottom 0.406: v46.98,10 46.98,7.07 47.49,6.57 47.49,4.79 X1.7
N$47  (via drill 0.8 pad 1.78)
  Top 0.406: MICRO.59 48.6,24.47 48.64,24.47 v48.64,7.96
  Bottom 0.406: X1.8 48.64,4.79 v48.64,7.96
N$51  (via drill 0.8 pad 1.78)
  other vias: 89.02,51.65
N$52  (via drill 0.8 pad 1.78)
  other vias: 70.23,96.61
N$53  (via drill 0.8 pad 1.78)
  other vias: 97.28,96.61
OUT1
  Top 0.813: C6.2
  Top 1.27: 16,82.64 14.22,80.86 MOTOR1.1
  Top 1.626: 16,82.64 C6.2 17.14,82.64 | 17.14,82.64 MOTOR_CONTROL.10 | 17.14,82.64 C6.2 | R1.2 17.11,82.66 17.14,82.64
  Top 1.778: D3.1 11.53,79.08 11.55,79.08 MOTOR1.1
  Bottom 1.626: D1.3 11.55,82.92 MOTOR1.1
OUT2
  Top 0.406: C7.1 16.76,68.67 23.62,68.67
  Top 0.61: 23.62,68.67 23.62,79.84
  Top 1.626: MOTOR_CONTROL.8 27.43,79.84 23.62,79.84 23.62,88.35 21.71,90.26 18.16,90.26 17.14,89.24 C3.2 11.55,87.59 11.43,87.46
  Top 1.778: 11.43,87.46 11.55,87.46 | 11.43,87.46 MOTOR2.1 | D2.1 11.4,87.46 11.43,87.46
  Bottom 1.626: D4.3 11.43,87.36 MOTOR2.1
RESET  (via drill 0.8 pad 1.78)
  Top 0.406: R30.2 50.69,42.15 50.67,42.13 | MICRO.20 50.16,39.97 50.16,41.62 50.67,42.13 | 59.18,42.13 50.67,42.13 | v59.3,39.71 59.3,42.13 | PROG.5 64.64,9.87 | v70.86,14.44 66.92,18.38 v66.92,23.46
  Top 0.61: 59.18,42.13 59.3,42.13 59.43,42.13 C10.2
  Top 1.778: R30.2 59.15,42.15
  Bottom 0.406: PROG.5 64.64,11.01 70.86,11.01 v70.86,14.44 | v66.92,23.46 68.58,23.46 68.58,37.05 65.91,39.71 v59.3,39.71
RXGPS  (via drill 0.8 pad 1.78)
  Top 0.406: MICRO.28 43.8,41.24 36.57,41.24 36.57,23.71 v37.84,23.71
  Bottom 0.406: v37.84,23.71 37.84,20.03 61.34,20.03 63.11,21.81 69.59,21.81 69.59,37.81 68.45,38.95 68.45,42.38 70.86,42.38 70.86,41.62
  Bottom 0.61: GPS.3 70.86,41.62
RXPROG  (via drill 0.8 pad 1.78)
  Top 0.356: FTDI.1 20.35,24.44 v20.7,24.09
  Top 0.406: v59.81,26 59.81,27.02 MICRO.2 68.7,27.02 68.7,19.39 70.86,17.23 72.26,17.23 72.26,9.23 v71.88,9.23
  Bottom 0.406: v71.88,9.23 69.72,9.23 PROG.9 | v59.81,26 59.69,26 58.8,26.89 25.9,26.89 23.11,24.09 v20.7,24.09
SCK  (via drill 0.8 pad 1.78)
  Top 0.406: MICRO.11 71.24,34.22 71.24,34 | 71.24,34 71.24,25.11 72.13,24.22 v72.26,24.22 | 71.24,34 71.24,34.12 | v72.26,20.15 72.26,18.25 73.15,18.25 73.15,10.25 v74.16,10.25
  Bottom 0.406: v72.26,20.15 v72.26,24.22 72.26,29.55 U$1.P$1 | v74.16,10.25 74.16,7.84 62.1,7.84 PROG.3 62.1,10
SENSE
  Top 1.626: R2.2 MOTOR_CONTROL.1
SERVOAZIMUT  (via drill 0.8 pad 1.78)
  Top 0.406: MICRO.15 65.78,37.43 v65.78,75.4
  Bottom 0.61: v65.78,75.4 64.51,75.4 SERVO.1
SERVOCAP  (via drill 0.8 pad 1.78)
  Top 0.406: MICRO.16 62.99,38.22 62.99,71.21 v61.97,72.22
  Bottom 0.61: v61.97,72.22 61.97,78.83 | 61.97,78.83 61.97,78.57 | 61.97,78.83 SERVO.2
SYNC  (via drill 0.8 pad 1.78)
  Top 0.406: MICRO.14 v85.09,36.62
  Bottom 0.61: v85.09,36.62 85.09,16.85 U$1.P$6 78.23,16.85
TXGPS  (via drill 0.8 pad 1.78)
  Top 0.406: MICRO.27 44.6,41.87 34.54,41.87 v34.54,24.47 | v57.91,23.71 61.46,20.15 v63.75,20.15
  Bottom 0.406: v63.75,20.15 70.61,20.15 70.61,37.94 69.62,38.92 GPS.4 | v57.91,23.71 56.38,25.23 35.43,25.23 34.67,24.47 v34.54,24.47
TXPROG  (via drill 0.8 pad 1.78)
  Top 0.254: FTDI.5 18.28,27.04
  Top 0.356: 21.84,27.04 19.81,27.04 | FTDI.5 21.84,27.04 | 21.84,27.04 v21.84,27.39
  Top 0.406: 63.88,27.82 69.72,27.82 69.72,21.55 73.53,21.55 74.04,21.04 74.04,12.03 v75.69,12.03 | 63.88,27.82 MICRO.3 | v63.88,29.55 63.88,27.82
  Bottom 0.406: v63.88,29.55 63.88,27.65 24.12,27.65 23.87,27.39 v21.84,27.39 | v75.69,12.03 75.69,6.95 59.56,6.95 PROG.1
VBAT_MEAS  (via drill 0.8 pad 1.78)
  Top 0.406: 58.54,88.73 56.51,88.73 v56.51,87.85 | 58.54,88.73 58.92,88.73 R16.2 58.92,88.86 58.54,88.86 58.54,88.73 | MICRO.61 50.2,21.68 v50.29,21.68
  Top 1.778: 58.92,88.73 58.92,88.86 R15.1
  Bottom 0.61: v50.29,21.68 61.59,21.68 65.78,25.87 67.31,25.87 67.31,34.12 51.68,34.12 51.68,43.27 57.02,43.27 57.02,50 54.99,50 54.99,55.46 49.14,55.46 49.14,85.18 51.81,87.85 v56.51,87.85
VREF
  Top 1.626: C2.1 MOTOR_CONTROL.18
YELLOWDIODE  (via drill 0.8 pad 1.78)
  Top 0.406: MICRO.30 42.2,38.44 40.38,38.44 38.98,39.84 v38.48,39.84
  Top 0.61: LED1.A 37.21,44.03 v34.92,44.03
  Bottom 0.61: v38.48,39.84 34.92,39.84 v34.92,44.03

### Text on the board
Top: Antenna Tracker
Bottom: J. Vacher ENAC-01/07